# Altium schematic sheet INPUT.SchDoc
size A
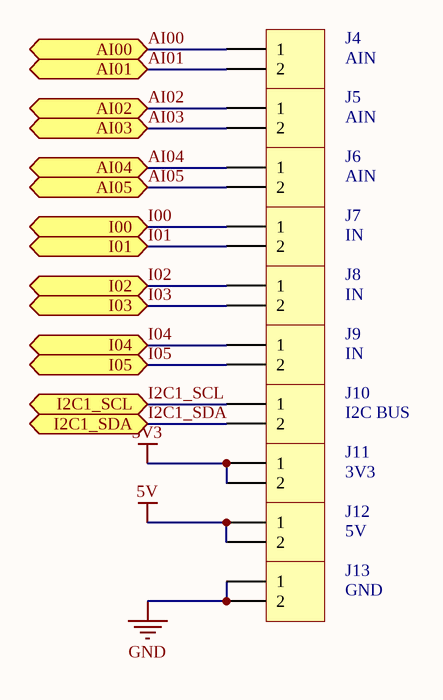
[diagram p0: INPUT.SchDoc]

## Parts
J4  AIN  [DOMINO NORMAL 2]
J5  AIN  [DOMINO NORMAL 2]
J6  AIN  [DOMINO NORMAL 2]
J7  IN  [DOMINO NORMAL 2]
J8  IN  [DOMINO NORMAL 2]
J9  IN  [DOMINO NORMAL 2]
J10  I2C BUS  [DOMINO NORMAL 2]
J11  3V3  [DOMINO NORMAL 2]
J12  5V  [DOMINO NORMAL 2]
J13  GND  [DOMINO NORMAL 2]

## Ports
AI00, AI01, AI02, AI03, AI04, AI05, I00, I01, I02, I2C1_SCL, I2C1_SDA, I03, I04, I05

## Nets
3V3: J11.1 J11.2
5V: J12.1 J12.2
GND: J13.1 J13.2
AI00: J4.1 ; port AI00
AI01: J4.2 ; port AI01
AI02: J5.1 ; port AI02
AI03: J5.2 ; port AI03
AI04: J6.1 ; port AI04
AI05: J6.2 ; port AI05
I00: J7.1 ; port I00
I01: J7.2 ; port I01
I02: J8.1 ; port I02
I2C1_SCL: J10.1 ; port I2C1_SCL
I2C1_SDA: J10.2 ; port I2C1_SDA
I03: J8.2 ; port I03
I04: J9.1 ; port I04
I05: J9.2 ; port I05

## Library data of the parts
J4-J13 = Header 2: Header, 2-Pin; LatestRevisionDate: 17-Jul-2002; LatestRevisionNote: Re-released for DXP Platform.; Publisher: Altium Limited